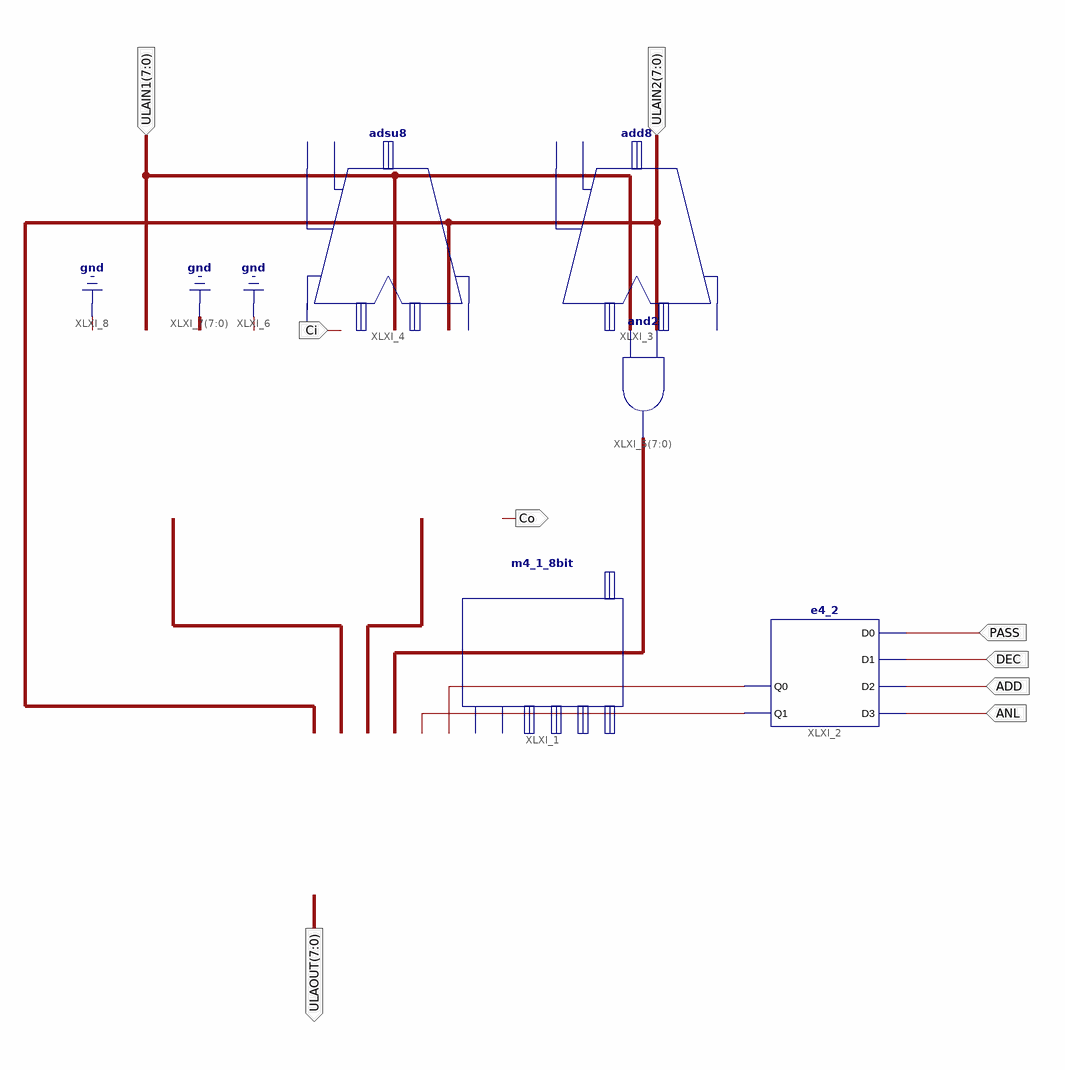
[diagram p0: schematic sheet 1]
// Xilinx ISE schematic ULA.sch (spartan3e) as structural Verilog: 5 symbols, 9 ports
module ULA (
  input  PASS,
  input  DEC,
  input  ADD,
  input  ANL,
  input  Ci,
  input  [7:0] ULAIN2,
  input  [7:0] ULAIN1,
  output [7:0] ULAOUT,
  output Co
);

  wire XLXN_1, XLXN_2;
  wire [7:0] XLXN_11, XLXN_12, XLXN_13;

  m4_1_8bit XLXI_1 (.D0(ULAIN2), .D1(XLXN_13), .D2(XLXN_12), .D3(XLXN_11), .O(ULAOUT), .S0(XLXN_1), .S1(XLXN_2));
  e4_2 XLXI_2 (.D0(PASS), .D1(DEC), .D2(ADD), .D3(ANL), .Q0(XLXN_1), .Q1(XLXN_2));
  adsu8 XLXI_4 (.A(ULAIN1), .ADD(1'b0), .B({8{1'b0}}), .CI(1'b0), .S(XLXN_13));  // open: CO, OFL
  add8 XLXI_3 (.A(ULAIN1), .B(ULAIN2), .CI(Ci), .CO(Co), .S(XLXN_12));  // open: OFL
  assign XLXN_11 = ULAIN1 & ULAIN2;  // and2 XLXI_5[7..0], 8 bits wide
endmodule
